# Altium project 20bit_40MS_ADC_DIOT.PrjPcb (part 1 of 5)
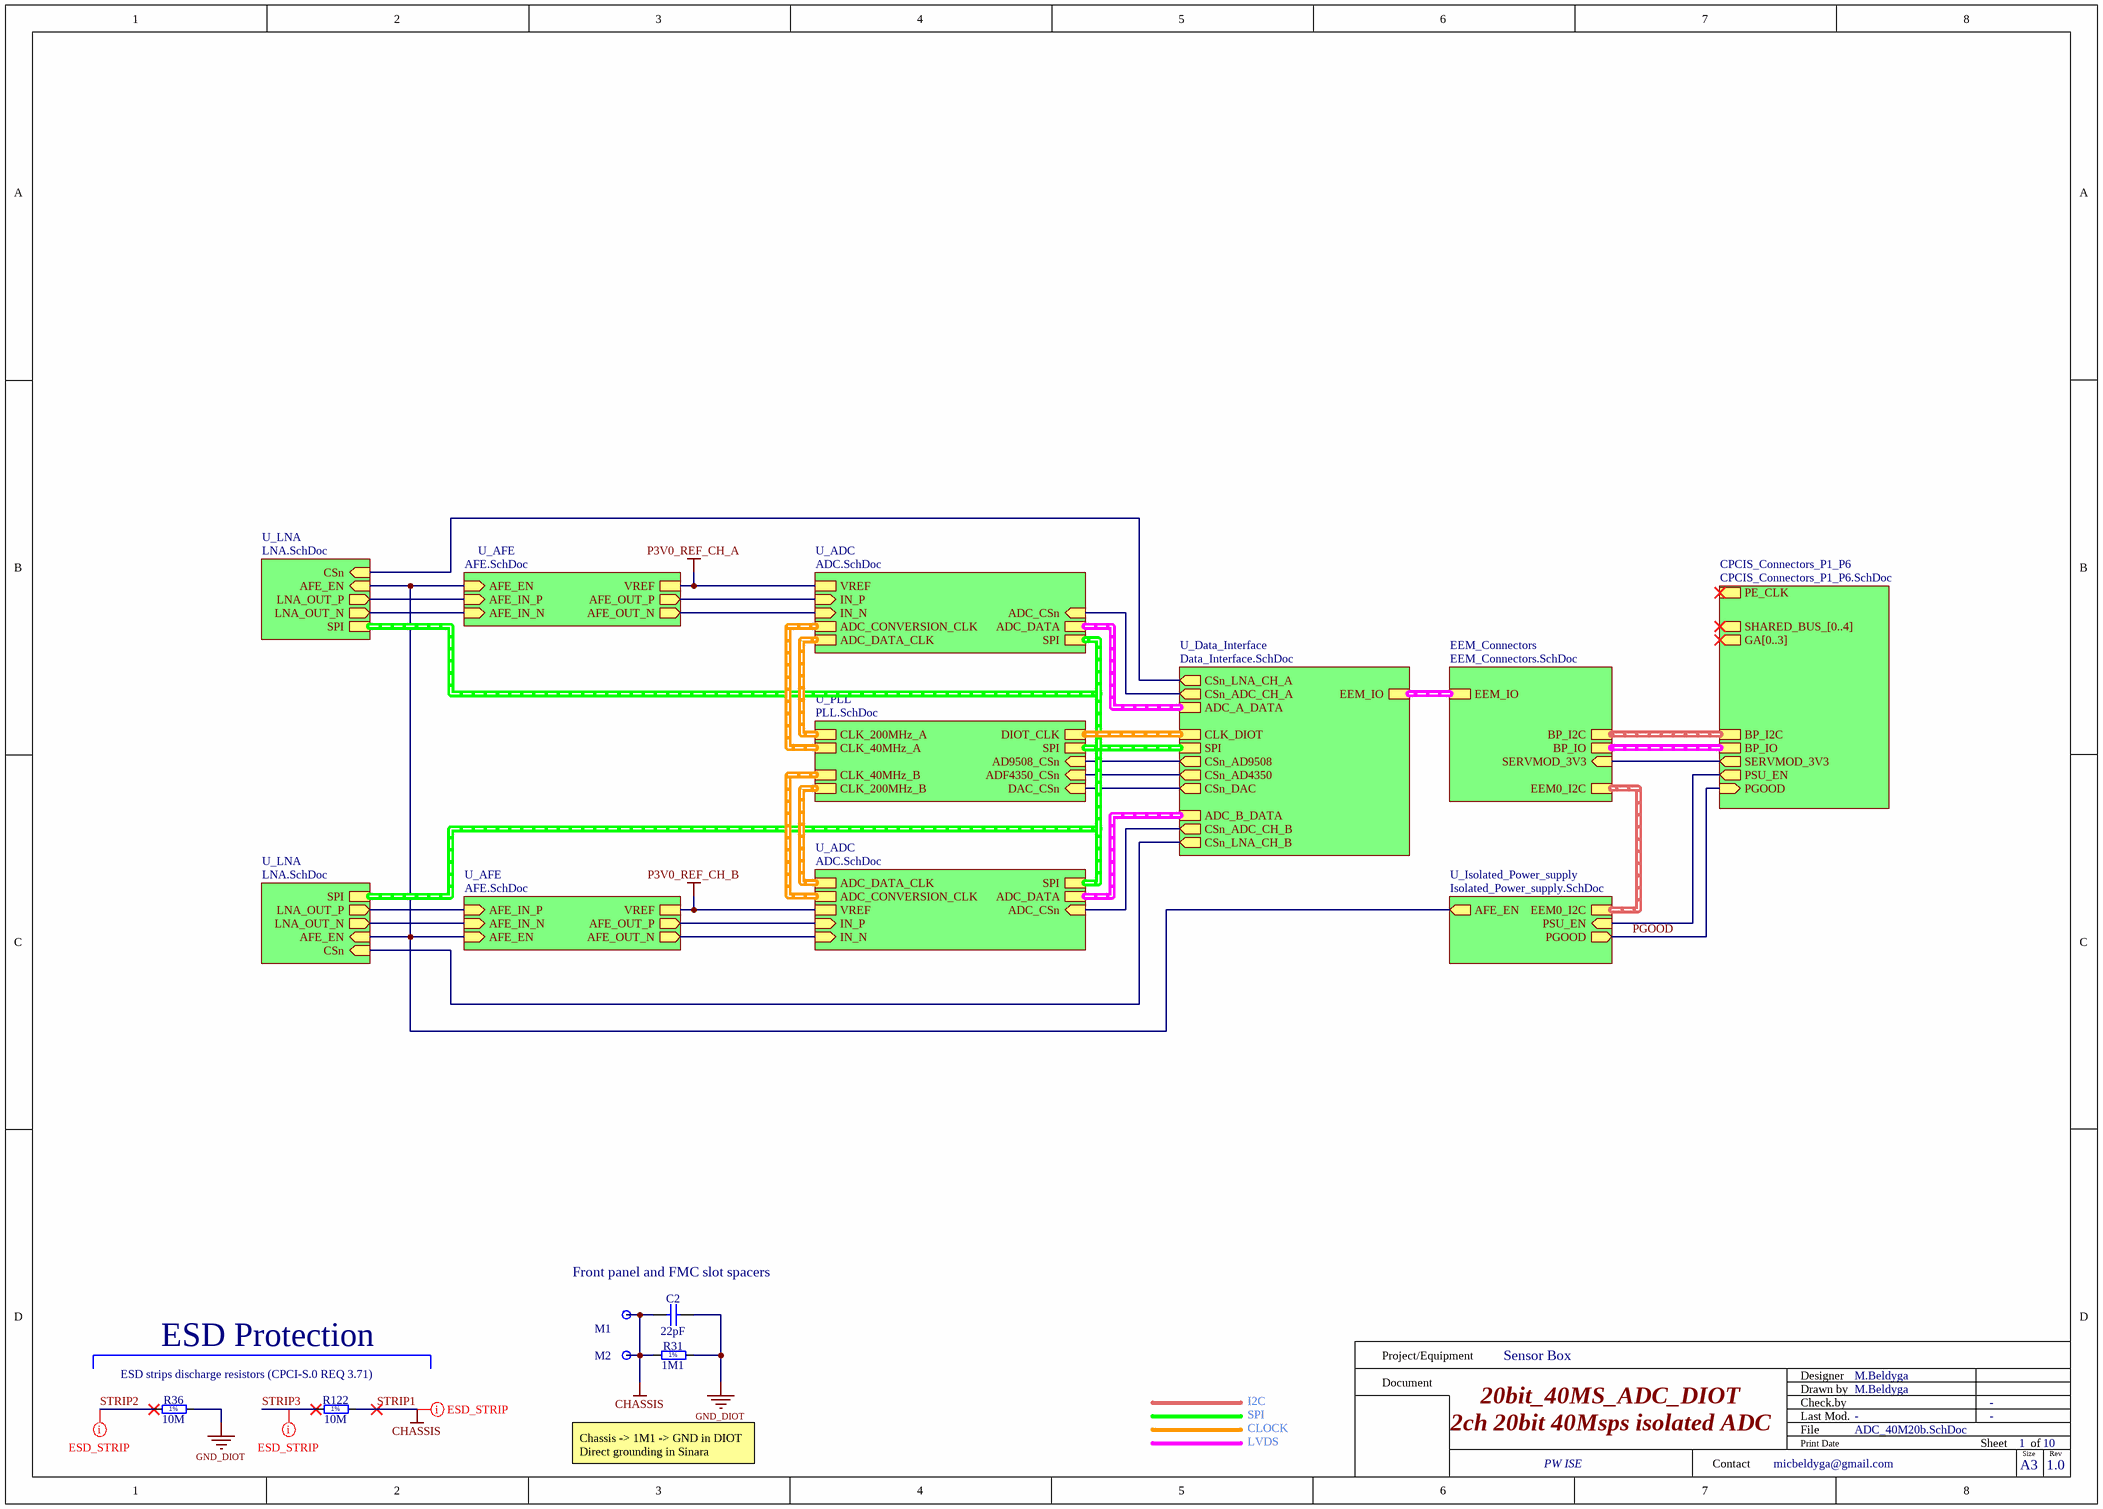
[diagram p0: ADC_40M20b.SchDoc]
Revision: 1.0
10 sheets, 625 parts. Net scope: hierarchical (ports join the sheet entries above them; power ports are global).
Board file: 20bit_40MS_ADC_DIOT.PcbDoc
Sheets:
  ADC_40M20b.SchDoc
    CPCIS_Connectors_P1_P6 = CPCIS_Connectors_P1_P6.SchDoc
    U_AFE = AFE.SchDoc
    U_LNA = LNA.SchDoc
    U_ADC = ADC.SchDoc
    U_PLL = PLL.SchDoc
    U_ADC = ADC.SchDoc
    U_AFE = AFE.SchDoc
    U_LNA = LNA.SchDoc
    U_Data_Interface = Data_Interface.SchDoc
      U_Optocouplers = Optocouplers.SchDoc
    EEM_Connectors = EEM_Connectors.SchDoc
    U_Isolated_Power_supply = Isolated_Power_supply.SchDoc

## Sheet ADC_40M20b.SchDoc: 20bit_40MS_ADC_DIOT
size A3; Author: M.Beldyga; CompanyName: WUT ISE; DrawnBy: M.Beldyga; Organization: WUT ISE; Address1: PW ISE; Address2: Nowowiejska 15/19 00-665 Warsaw; Address3: micbeldyga@gmail.com; SheetNumber: 1; SheetTotal: 10; ModifiedBy: -; CheckedDate: -; Title2: 2ch 20bit 40Msps isolated ADC; DivGrp: WUT ISE; Designer: M.Beldyga; ModifiedDate: -; ProjectName: Sensor Box

### Parts
C2  22pF  [CAPC1005X55N]
M1  Plated Hole  [MTG300_600]  (value not drawn)  (no BOM)
M2  Plated Hole  [MTG300_600]  (value not drawn)  (no BOM)
R31  1M1  [RESC2012X60N]
R36  10M  [RESC2113X55N]
R122  10M  [RESC2113X55N]

### Sub-sheets
CPCIS_Connectors_P1_P6 = CPCIS_Connectors_P1_P6.SchDoc: BP_I2C (harness I2C), SERVMOD_3V3 (out), PSU_EN (out), PE_CLK (harness CLK_DIFF), GA[0..3] (out), BP_IO (harness EEM_LVDS), SHARED_BUS_[0..4] (out), PGOOD (in)
EEM_Connectors = EEM_Connectors.SchDoc: EEM_IO (harness EEM_LVDS), BP_IO (harness EEM_LVDS), EEM0_I2C (harness I2C), BP_I2C (harness I2C), SERVMOD_3V3 (in)
U_ADC = ADC.SchDoc: ADC_DATA (harness ADC_LVDS), SPI (harness SPI), ADC_CONVERSION_CLK (harness DIFF_CLK), ADC_DATA_CLK (harness DIFF_CLK), IN_P (in), IN_N (in), ADC_CSn (in), VREF
U_ADC = ADC.SchDoc: ADC_DATA (harness ADC_LVDS), SPI (harness SPI), ADC_CONVERSION_CLK (harness DIFF_CLK), ADC_DATA_CLK (harness DIFF_CLK), IN_P (in), IN_N (in), ADC_CSn (in), VREF
U_AFE = AFE.SchDoc: AFE_OUT_P (out), AFE_OUT_N (out), AFE_IN_P (in), AFE_IN_N (in), AFE_EN (in), VREF
U_AFE = AFE.SchDoc: AFE_OUT_P (out), AFE_OUT_N (out), AFE_IN_P (in), AFE_IN_N (in), AFE_EN (in), VREF
U_Data_Interface = Data_Interface.SchDoc: ADC_A_DATA (harness ADC_LVDS), ADC_B_DATA (harness ADC_LVDS), SPI (harness SPI), CLK_DIOT (harness DIFF_CLK), CSn_ADC_CH_A (out), CSn_ADC_CH_B (out), CSn_AD9508 (out), CSn_AD4350 (out), CSn_LNA_CH_A (out), CSn_LNA_CH_B (out), EEM_IO (harness EEM_LVDS), CSn_DAC (out)
U_Isolated_Power_supply = Isolated_Power_supply.SchDoc: PSU_EN (in), EEM0_I2C (harness I2C), PGOOD (out), AFE_EN (out)
U_LNA = LNA.SchDoc: LNA_OUT_P (out), LNA_OUT_N (out), SPI (harness SPI), AFE_EN (in), CSn (in)
U_LNA = LNA.SchDoc: LNA_OUT_P (out), LNA_OUT_N (out), SPI (harness SPI), AFE_EN (in), CSn (in)
U_PLL = PLL.SchDoc: CLK_40MHz_A (harness DIFF_CLK), CLK_200MHz_A (harness DIFF_CLK), CLK_40MHz_B (harness DIFF_CLK), CLK_200MHz_B (harness DIFF_CLK), SPI (harness SPI), ADF4350_CSn (in), AD9508_CSn (in), DIOT_CLK (harness DIFF_CLK), DAC_CSn (in)

### Nets
GND_DIOT: C2.2 R31.2 R36.2  [project net GND]
P3V0_REF_CH_A: sheet U_AFE/VREF, sheet U_ADC/VREF, sheet U_ADC/VREF, sheet U_AFE/VREF  [also labelled P3V0_REF_CH_B]  [project net P3V0_REF]
STRIP1: C2.1 M1.1 M2.1 R31.1 R122.2  [also labelled CHASSIS]
ADC_CSn: sheet U_ADC/ADC_CSn, sheet U_Data_Interface/CSn_ADC_CH_A
ADC_CSn: sheet U_ADC/ADC_CSn, sheet U_Data_Interface/CSn_ADC_CH_B  [a separate net that carries the same name]
ADCIN_N: sheet U_AFE/AFE_OUT_N, sheet U_ADC/IN_N
ADCIN_N: sheet U_ADC/IN_N, sheet U_AFE/AFE_OUT_N  [a separate net that carries the same name]
ADCIN_P: sheet U_AFE/AFE_OUT_P, sheet U_ADC/IN_P
ADCIN_P: sheet U_ADC/IN_P, sheet U_AFE/AFE_OUT_P  [a separate net that carries the same name]
AFE_EN: sheet U_AFE/AFE_EN, sheet U_LNA/AFE_EN, sheet U_AFE/AFE_EN, sheet U_LNA/AFE_EN, sheet U_Isolated_Power_supply/AFE_EN
AFE_IN_N: sheet U_AFE/AFE_IN_N, sheet U_LNA/LNA_OUT_N
AFE_IN_N: sheet U_AFE/AFE_IN_N, sheet U_LNA/LNA_OUT_N  [a separate net that carries the same name]
AFE_IN_P: sheet U_AFE/AFE_IN_P, sheet U_LNA/LNA_OUT_P
AFE_IN_P: sheet U_AFE/AFE_IN_P, sheet U_LNA/LNA_OUT_P  [a separate net that carries the same name]
CSn_AD4350: sheet U_PLL/ADF4350_CSn, sheet U_Data_Interface/CSn_AD4350
CSn_AD9508: sheet U_PLL/AD9508_CSn, sheet U_Data_Interface/CSn_AD9508
CSn_DAC: sheet U_PLL/DAC_CSn, sheet U_Data_Interface/CSn_DAC
CSn_LNA_CH_A: sheet U_LNA/CSn, sheet U_Data_Interface/CSn_LNA_CH_A
CSn_LNA_CH_B: sheet U_LNA/CSn, sheet U_Data_Interface/CSn_LNA_CH_B
PGOOD: sheet CPCIS_Connectors_P1_P6/PGOOD, sheet U_Isolated_Power_supply/PGOOD
PSU_EN: sheet CPCIS_Connectors_P1_P6/PSU_EN, sheet U_Isolated_Power_supply/PSU_EN
SERVMOD_3V3: sheet CPCIS_Connectors_P1_P6/SERVMOD_3V3, sheet EEM_Connectors/SERVMOD_3V3
STRIP2: R36.1
STRIP3: R122.1

### Buses and harness runs
harness sheet CPCIS_Connectors_P1_P6/BP_I2C = sheet EEM_Connectors/BP_I2C
harness sheet CPCIS_Connectors_P1_P6/BP_IO = sheet EEM_Connectors/BP_IO
harness sheet EEM_Connectors/EEM0_I2C = sheet U_Isolated_Power_supply/EEM0_I2C
harness sheet EEM_Connectors/EEM_IO = sheet U_Data_Interface/EEM_IO
harness sheet U_ADC/ADC_CONVERSION_CLK = sheet U_PLL/CLK_40MHz_A
harness sheet U_ADC/ADC_CONVERSION_CLK = sheet U_PLL/CLK_40MHz_B
harness sheet U_ADC/ADC_DATA = sheet U_Data_Interface/ADC_A_DATA
harness sheet U_ADC/ADC_DATA = sheet U_Data_Interface/ADC_B_DATA
harness sheet U_ADC/ADC_DATA_CLK = sheet U_PLL/CLK_200MHz_A
harness sheet U_ADC/ADC_DATA_CLK = sheet U_PLL/CLK_200MHz_B
harness sheet U_ADC/SPI = sheet U_Data_Interface/SPI = sheet U_LNA/SPI = sheet U_PLL/SPI
harness sheet U_Data_Interface/CLK_DIOT = sheet U_PLL/DIOT_CLK

### Layout directives
net class ESD_STRIP: STRIP1, STRIP2, STRIP3

### Notes on the sheet
- Front panel and FMC slot spacers
- ESD strips discharge resistors (CPCI-S.0 REQ 3.71)
- ESD Protection
- Chassis -> 1M1 -> GND in DIOT
  Direct grounding in Sinara
- I2C
- SPI
- CLOCK
- LVDS
- Project/Equipment
- Document
- Designer
- Drawn by
- Check.by
- Contact
- File
- Last Mod.
- Print Date
- Sheet
- Size
- A3
- of
- Rev
- (in symbol R0805_1M1_1%_0.125W_100PPM) 1%
- (in symbol R0805_10M_1%_0.125W_100PPM_VISHAY_CRCW e3) 1%

### Library data of the parts
C2 = CC0402_22PF_50V_5%_C0G: Non-polarised capacitor; Part Description: SMD Multilayer Chip Ceramic Capacitor; Manufacturer: GENERIC; Manufacturer1 Part Number: C0402C220J5GACTU; Voltage: 50V; TC: C0G/NP0; Tolerance: ±5%; Part Number: CC0402_22PF_50V_5%_C0G; Component Kind: Standard; Component Type: Standard; Pin Count: 2; Value: 22pF; Status: Preferred; Manufacturer Part Number: CC0402_22PF_50V_5%_C0G; Case: 0402; Mounted: Yes; Socket: No; SMD: Yes; Manufacturer1 Example: KEMET; Manufacturer1 ComponentHeight: 0.55mm; HelpURL: \\cern.ch\dfs\Applications\Altium\Datasheets\CC0402_C0G_KEMET_(Commercial Grade).pdf; Author: CERN DEM JLC; CreateDate: 2007-12-03; LatestRevisionDate: 2007-12-03; Sense: No
M1 M2 = PLATED_HOLE3.0_PAD6.0: Single Terminal Socket; Part Description: Plated Through Hole: Hole Dia.=3.0mm Pad Dia.=6.0mm; Mounted: No; Table: Pads; Part Number: PLATED_HOLE3.0_PAD6.0; Component Type: Standard (No BOM); Designator: Single Terminal Socket; Library Reference: Single Terminal Socket; Pin Count: 1; Family: Plated Hole; Socket: No; SMD: No; Status: None; ComponentHeight: 0mm; Author: CERN DEM JLC; CreateDate: 26.05.2008; LatestRevisionDate: 26.05.2008; PackageDescription: Plated Through Hole: Hole Dia.=3.0mm Pad Dia.=6.0mm
R31 = R0805_1M1_1%_0.125W_100PPM: Resistor - 1%; Part Description: General Purpose Thick Film Chip Resistor; Manufacturer: GENERIC; Manufacturer1 Part Number: NRC10F1104TRF; PressFit: No; Part Number: R0805_1M1_1%_0.125W_100PPM; Component Kind: Standard; Component Type: Standard; Pin Count: 2; Value: 1M1; Status: Preferred; Manufacturer Part Number: R0805_1M1_1%_0.125W_100PPM; Case: 0805; Mounted: Yes; Sense: No; Socket: No; SMD: Yes; Manufacturer1 Example: NIC COMPONENT; Manufacturer1 ComponentHeight: 0.6mm; HelpURL: \\cern.ch\dfs\Applications\Altium\Datasheets\R0805_NIC_NRC.pdf; Author: CERN DEM JLC; CreateDate: 03/12/2007; LatestRevisionDate: 13/03/2008
R36 R122 = R0805_10M_1%_0.125W_100PPM_VISHAY_CRCW e3: Resistor - 1%; Part Description: 150V, Standard Thick Film Chip Resistor; Manufacturer: VISHAY DALE; Manufacturer Part Number: CRCW080510M0FKEA; Power: 0.125W; TC: ±100ppm/°C; PressFit: No; Part Number: R0805_10M_1%_0.125W_100PPM_VISHAY_CRCW e3; Component Kind: Standard; Component Type: Standard; Pin Count: 2; Value: 10M; Status: None; Tolerance: ±1%; Case: 0805; Mounted: Yes; Sense: No; Socket: No; SMD: Yes; ComponentHeight: 0.5mm; HelpURL: \\cern.ch\dfs\Applications\Altium\Datasheets\R0805_VISHAY_CRCW e3.pdf; Author: CERN DEM BC; CreateDate: 2019-11-12; LatestRevisionDate: 2019-11-12

## Sheet CPCIS_Connectors_P1_P6.SchDoc: DIOT
size 420 x 297 mm; SPICEModelCacheRMUUFYQV: <root> / <DocumentId>RMUUFYQV</DocumentId> / </root>; CheckedBy: P.Kulik; Author: G.Kasprowicz; CompanyName: WUT ISE; DrawnBy: G.Kasprowicz; Organization: WUT ISE; Address1: PW ISE; Address2: Nowowiejska 15/19 00-665 Warsaw; Address3: gkasprow@gmail.com; Revision: 2; SheetNumber: 9; SheetTotal: 10; ModifiedBy: -; CheckedDate: -; Title2: connectors; DivGrp: WUT ISE; Designer: G.Kasprowicz; ModifiedDate: -; ProjectName: Sensor Box
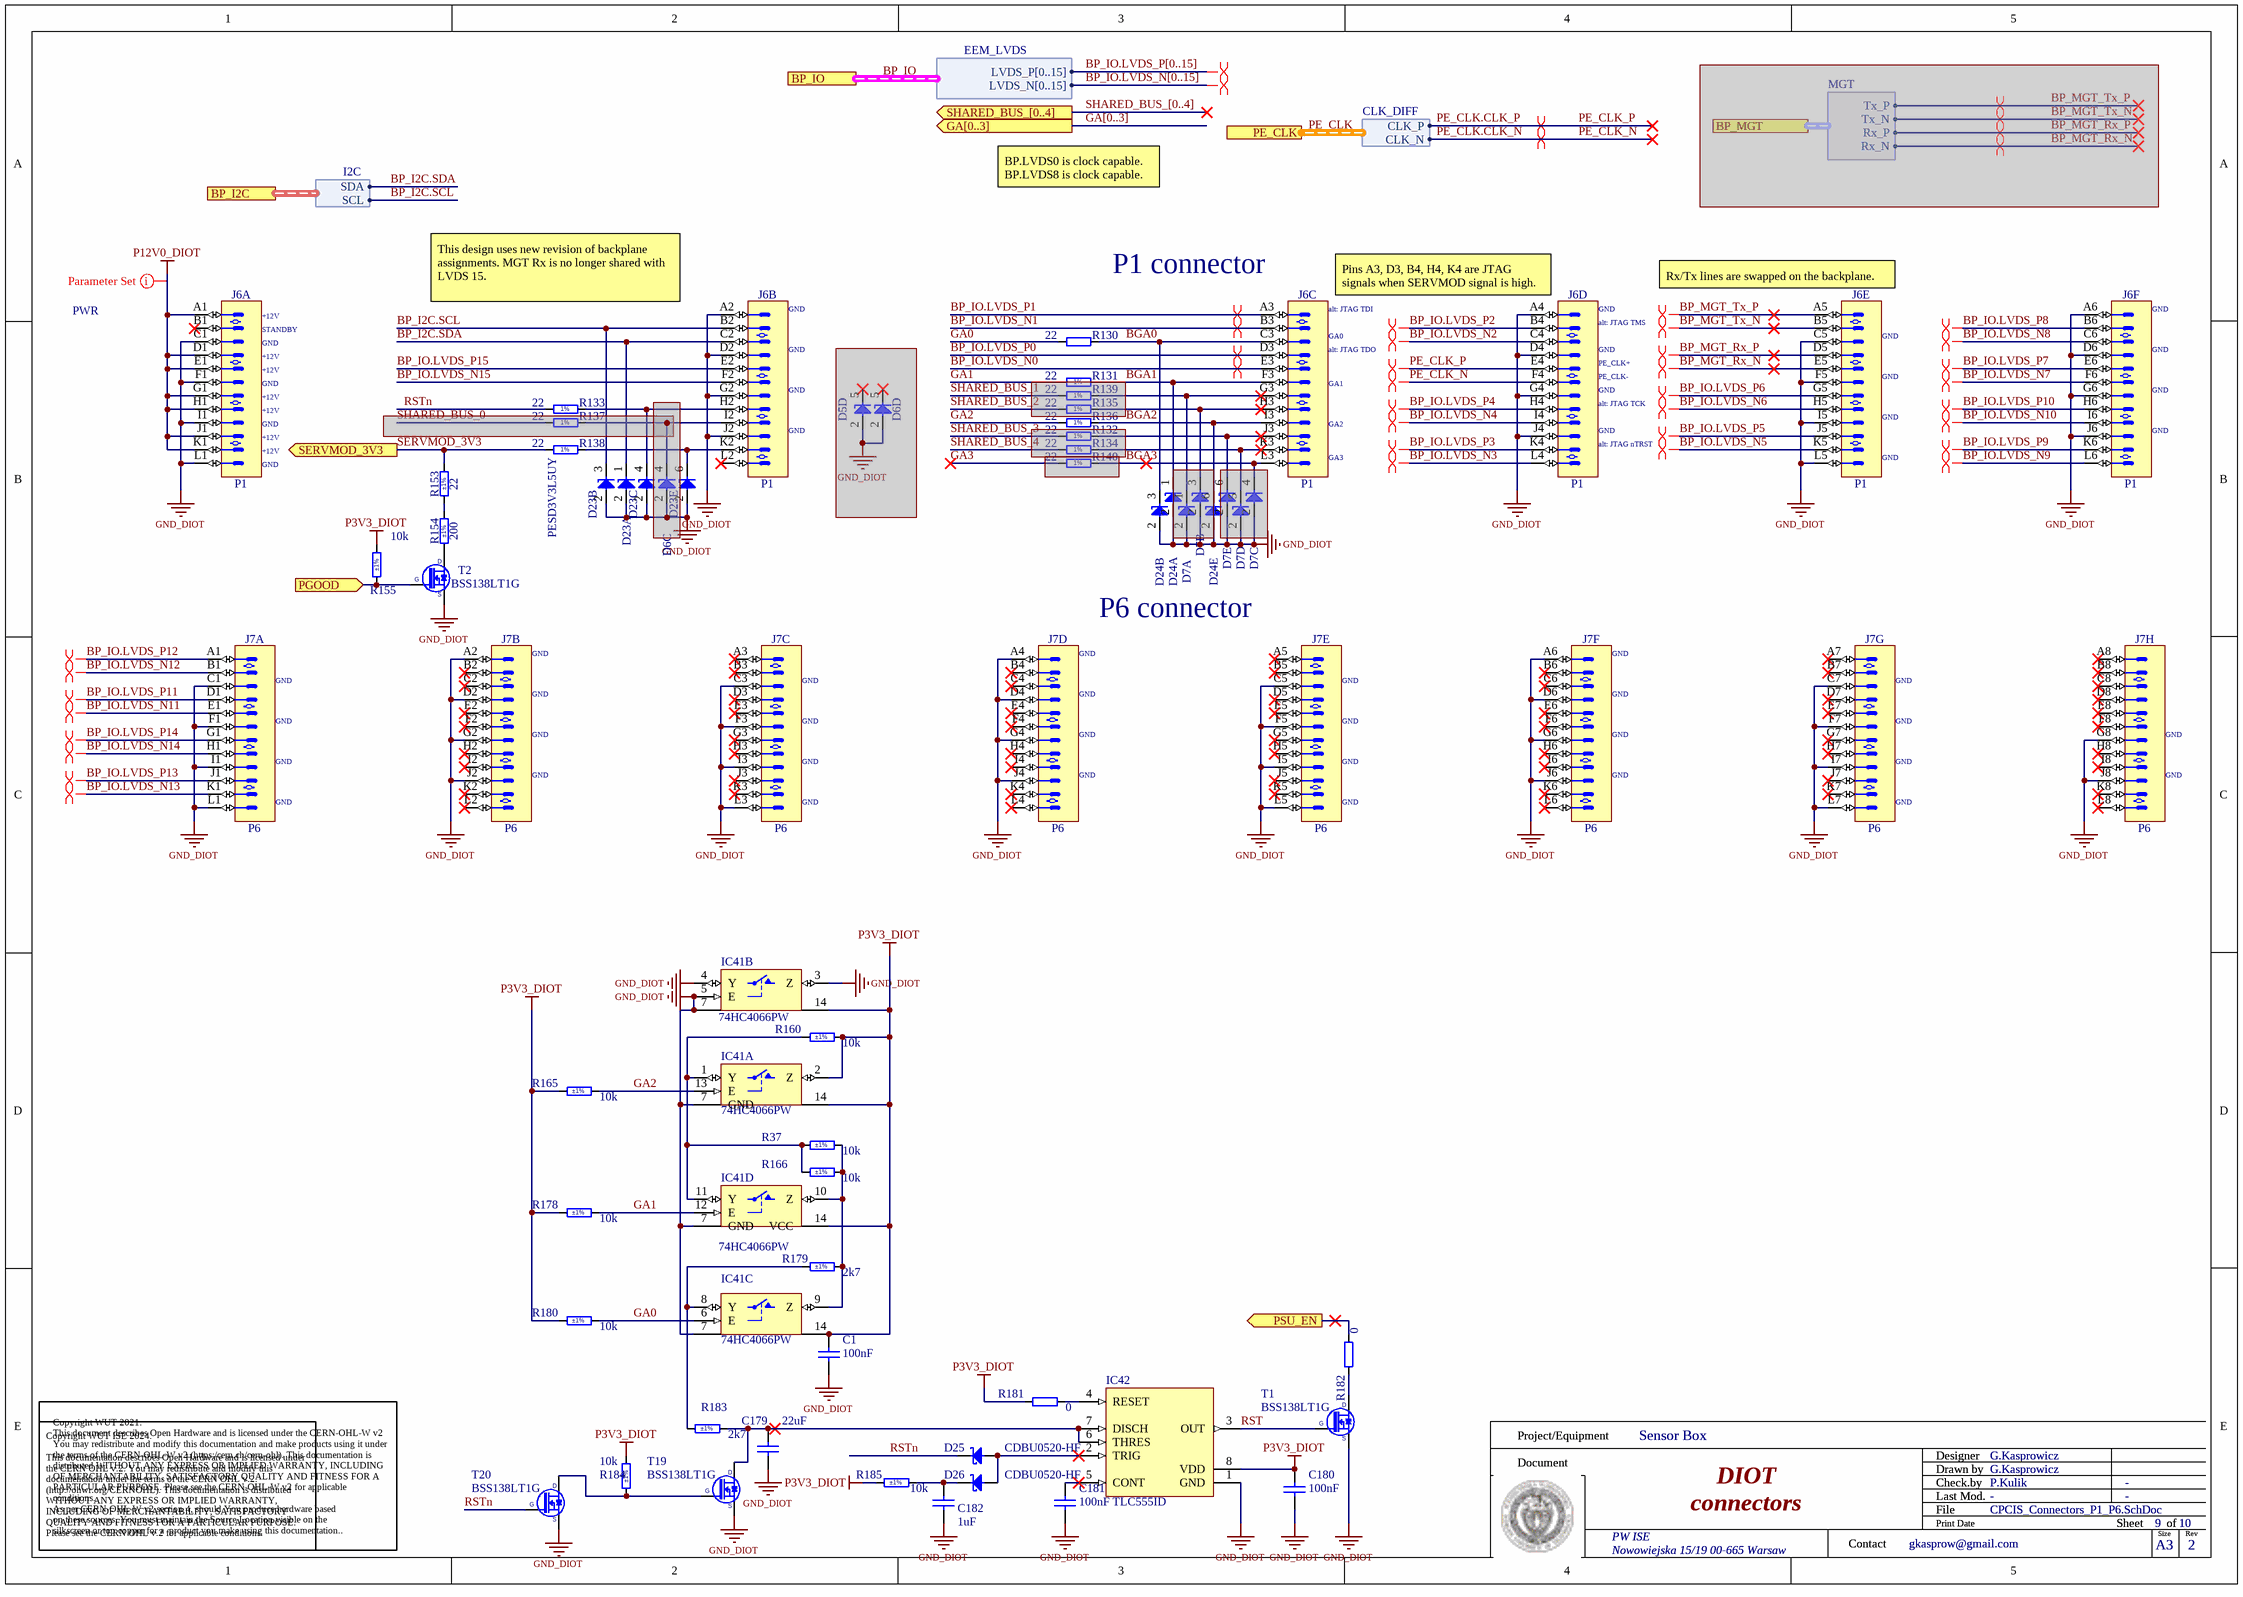
[diagram p1: CPCIS_Connectors_P1_P6.SchDoc]

### Parts
(Parts that share a designator on the sheet are numbered #1, #2 ... from top to bottom, then left to right.)
C1  100nF  [CAPC1005X55N]
C179  22uF  [CAPC2012X135N]
C180  100nF  [CAPC1005X55N]
C181  100nF  [CAPC1005X55N]
C182  1uF  [CAPC1608X87N]
D5#1  PESD3V3L5UY  [SOT65P210X110-6N]  (value not drawn)  (part D of 5)  (masked out: inside a compile mask, not in the netlist)
D6#1  PESD3V3L5UY  [SOT65P210X110-6N]  (value not drawn)  (parts C,D of 5)  (masked out: inside a compile mask, not in the netlist)
D7#1  PESD3V3L5UY  [SOT65P210X110-6N]  (value not drawn)  (parts A,B,C,D,E of 5)  (masked out: inside a compile mask, not in the netlist)
D23  PESD3V3L5UY  [SOT65P210X110-6N]  (value not drawn)  (parts A,B,C,E of 5)
D24  PESD3V3L5UY  [SOT65P210X110-6N]  (value not drawn)  (parts A,B,E of 5)  (masked out: inside a compile mask, not in the netlist)
D25  CDBU0520-HF  [SOD-523F]
D26  CDBU0520-HF  [SOD-523F]
IC41  74HC4066PW  [SOP65P640X110-14N]  (parts A,B,C,D of 4)
IC42  TLC555ID  [SOIC127P600X175-8N]
J6  P1  [AMPHENOL_10052825-101LF]  (parts A,B,C,D,E,F of 6)
J7  P6  [AMPHENOL_10052838-101LF]  (parts A,B,C,D,E,F,G,H of 8)
R37  10k  Tolerance: ±1%  [RESC1608X55N]
R130  22  [RESC1005X40N]
R131  22  [RESC1005X40N]  (masked out: inside a compile mask, not in the netlist)
R132#1  22  [RESC1005X40N]  (masked out: inside a compile mask, not in the netlist)
R133  22  [RESC1005X40N]
R134#1  22  [RESC1005X40N]  (masked out: inside a compile mask, not in the netlist)
R135#1  22  [RESC1005X40N]  (masked out: inside a compile mask, not in the netlist)
R136  22  [RESC1005X40N]
R137#1  22  [RESC1005X40N]  (masked out: inside a compile mask, not in the netlist)
R138  22  [RESC1005X40N]
R139#1  22  [RESC1005X40N]  (masked out: inside a compile mask, not in the netlist)
R140#1  22  [RESC1005X40N]  (masked out: inside a compile mask, not in the netlist)
R153  22  Tolerance: ±1%  [RESC1005X40N]
R154  200  Tolerance: ±1%  [RESC1005X40N]
R155  10k  Tolerance: ±1%  [RESC1608X55N]
R160  10k  Tolerance: ±1%  [RESC1608X55N]
R165  10k  Tolerance: ±1%  [RESC1608X55N]
R166  10k  Tolerance: ±1%  [RESC1608X55N]
R178  10k  Tolerance: ±1%  [RESC1608X55N]
R179  2k7  Tolerance: ±1%  [RESC1608X55N]
R180  10k  Tolerance: ±1%  [RESC1608X55N]
R181  0  [RESC1005X40N]
R182  0  [RESC1005X40N]
R183  2k7  Tolerance: ±1%  [RESC1608X55N]
R184  10k  Tolerance: ±1%  [RESC1608X55N]
R185  10k  Tolerance: ±1%  [RESC1608X55N]
T1  BSS138LT1G  [SOT95P240X110-3N]
T2  BSS138LT1G  [SOT95P240X110-3N]
T19  BSS138LT1G  [SOT95P240X110-3N]
T20  BSS138LT1G  [SOT95P240X110-3N]

### Ports
BP_I2C (harness I2C), BP_IO (harness EEM_LVDS), BP_MGT (harness MGT), GA[0..3] (out), PE_CLK (harness CLK_DIFF), PGOOD (in), PSU_EN (out), SERVMOD_3V3 (out), SHARED_BUS_[0..4] (out)

### Harnesses
MGT: Tx_P, Tx_N, Rx_P, Rx_N
CLK_DIFF: CLK_N, CLK_P
I2C: SDA, SCL
EEM_LVDS: LVDS_P[0..15], LVDS_N[0..15]

### Nets
GND: C1.1 C179.1 C180.1 C181.1 C182.1 D23.2(A) D24.2(A) IC41.3(Z) IC41.4(Y) IC41.5(E) IC41.7(GND) IC42.1(GND) J6.A2 J6.A4 J6.A6 J6.C1 J6.C5 J6.D2 J6.D4 J6.D6 J6.F1 J6.F5 J6.G2 J6.G4 J6.G6 J6.I1 J6.I5 J6.J2 J6.J4 J6.J6 J6.L1 J6.L5 J7.A2 J7.A4 J7.A6 J7.C1 J7.C3 J7.C5 J7.C7 J7.D2 J7.D4 J7.D6 J7.F1 J7.F3 J7.F5 J7.F7 J7.G2 J7.G4 J7.G6 J7.G8 J7.I1 J7.I3 J7.I5 J7.I7 J7.J2 J7.J4 J7.J6 J7.J8 J7.L1 J7.L3 J7.L5 J7.L7 T1.2(S) T2.2(S) T19.2(S) T20.2(S)  [also labelled GND_DIOT]
P3V3_DIOT: C1.2 C180.2 IC41.2(Z) IC41.14(VCC) IC42.8(VDD) R155.2 R160.2 R165.1 R178.1 R180.1 R181.1 R184.2 R185.1
P12V0_DIOT: J6.A1 J6.D1 J6.E1 J6.G1 J6.H1 J6.J1 J6.K1
BGA0: D24.3(C) J6.C3 R130.2
BGA2: J6.I3 R136.2
BGA3: J6.L3
BP_I2C.SCL: D23.3(C) J6.B2 ; port BP_I2C.SCL
BP_I2C.SDA: D23.1(C) J6.C2 ; port BP_I2C.SDA
BP_IO.LVDS_N0: J6.E3
BP_IO.LVDS_N1: J6.B3
BP_IO.LVDS_N2: J6.C4
BP_IO.LVDS_N3: J6.L4
BP_IO.LVDS_N4: J6.I4
BP_IO.LVDS_N5: J6.K5
BP_IO.LVDS_N6: J6.H5
BP_IO.LVDS_N7: J6.F6
BP_IO.LVDS_N8: J6.C6
BP_IO.LVDS_N9: J6.L6
BP_IO.LVDS_N10: J6.I6
BP_IO.LVDS_N11: J7.E1
BP_IO.LVDS_N12: J7.B1
BP_IO.LVDS_N13: J7.K1
BP_IO.LVDS_N14: J7.H1
BP_IO.LVDS_N15: J6.F2
BP_IO.LVDS_P0: J6.D3
BP_IO.LVDS_P1: J6.A3
BP_IO.LVDS_P2: J6.B4
BP_IO.LVDS_P3: J6.K4
BP_IO.LVDS_P4: J6.H4
BP_IO.LVDS_P5: J6.J5
BP_IO.LVDS_P6: J6.G5
BP_IO.LVDS_P7: J6.E6
BP_IO.LVDS_P8: J6.B6
BP_IO.LVDS_P9: J6.K6
BP_IO.LVDS_P10: J6.H6
BP_IO.LVDS_P11: J7.D1
BP_IO.LVDS_P12: J7.A1
BP_IO.LVDS_P13: J7.J1
BP_IO.LVDS_P14: J7.G1
BP_IO.LVDS_P15: J6.E2
BP_MGT_Rx_N: J6.E5
BP_MGT_Rx_P: J6.D5
BP_MGT_Tx_N: J6.B5
BP_MGT_Tx_P: J6.A5
GA0: IC41.6(E) R130.1 R180.2
GA1: IC41.12(E) R178.2
GA2: IC41.13(E) R136.1 R165.2
PE_CLK.CLK_N: J6.F4 ; port PE_CLK.CLK_N  [also labelled PE_CLK_N]
PE_CLK.CLK_P: J6.E4 ; port PE_CLK.CLK_P  [also labelled PE_CLK_P]
PGOOD: R155.1 T2.1(G) ; port PGOOD
PSU_EN: R182.2 ; port PSU_EN
RST: IC42.3(OUT) T1.1(G)
RSTn: D25.1(C) R133.1 T20.1(G)
SERVMOD_3V3: R138.1 R153.2 ; port SERVMOD_3V3
NetC179_2: C179.2 IC42.6(THRES) IC42.7(DISCH) R183.2 T19.3(D)
NetC181_2: C181.2 IC42.5(CONT)
NetC182_2: C182.2 D26.1(C) R185.2
NetD23_4: D23.4(C) J6.H2 R133.2
NetD23_6: D23.6(C) J6.K2 R138.2
NetD25_2: D25.2(A) D26.2(A) IC42.2(TRIG)
NetIC41_1: IC41.1(Y) IC41.11(Y) R37.1 R160.1 R166.1
NetIC41_8: IC41.8(Y) R179.1 R183.1
NetIC41_9: IC41.9(Z) IC41.10(Z) R37.2 R166.2 R179.2
NetIC42_4: IC42.4(RESET) R181.2
NetR153_1: R153.1 R154.2
NetR154_1: R154.1 T2.3(D)
NetR182_1: R182.1 T1.3(D)
NetR184_1: R184.1 T19.1(G) T20.3(D)

Not connected (* = marked no-connect by the designer): J6 B1* F3 G3* H3* I2 J3* K3* L2*; J7 A3* A5* A7* A8* B2* B3* B4* B5* B6* B7* B8* C2* C4* C6* C8* D3* D5* D7* D8* E2* E3* E4* E5* E6* E7* E8* F2* F4* F6* F8* G3* G5* G7* H2* H3* H4* H5* H6* H7* H8* I2* I4* I6* I8* J3* J5* J7* K2* K3* K4* K5* K6* K7* K8* L2* L4* L6* L8*

### Buses and harness runs
bus BP_IO.LVDS_N[0..15]
bus BP_IO.LVDS_P[0..15]
bus GA[0..3] = port GA[0..3]
bus SHARED_BUS_[0..4] = port SHARED_BUS_[0..4]
harness BP_IO = port BP_IO
harness PE_CLK = port PE_CLK

### Layout directives
differential pair: (no net found under the mark), BP_IO.LVDS_N0, BP_IO.LVDS_N1, BP_IO.LVDS_N2, BP_IO.LVDS_N3, BP_IO.LVDS_N4, BP_IO.LVDS_N5, BP_IO.LVDS_N6, BP_IO.LVDS_N7, BP_IO.LVDS_N8, BP_IO.LVDS_N9, BP_IO.LVDS_N10, BP_IO.LVDS_N11, BP_IO.LVDS_N12, BP_IO.LVDS_N13, BP_IO.LVDS_N14, BP_IO.LVDS_P0, BP_IO.LVDS_P1, BP_IO.LVDS_P2, BP_IO.LVDS_P3, BP_IO.LVDS_P4, BP_IO.LVDS_P5, BP_IO.LVDS_P6, BP_IO.LVDS_P7, BP_IO.LVDS_P8, BP_IO.LVDS_P9, BP_IO.LVDS_P10, BP_IO.LVDS_P11, BP_IO.LVDS_P12, BP_IO.LVDS_P13, BP_IO.LVDS_P14
differential pair; differential pair class Diff_100Ohm: PE_CLK.CLK_N, PE_CLK.CLK_P
differential pair; differential pair class MGT: (no net found under the mark), BP_MGT_Rx_N, BP_MGT_Rx_P, BP_MGT_Tx_N, BP_MGT_Tx_P
net class PWR: P12V0_DIOT

### Notes on the sheet
- BP.LVDS0 is clock capable.
  BP.LVDS8 is clock capable.
- (near J6) +12V
- This design uses new revision of backplane assignments. MGT Rx is no longer shared with LVDS 15.
- (near J6) GND
- (near J6) P1 connector
- (near J6) alt: JTAG TDI
- (near J6) Pins A3, D3, B4, H4, K4 are JTAG signals when SERVMOD signal is high.
- (near J6) alt: JTAG TMS
- (near J6) Rx/Tx lines are swapped on the backplane.
- (near J6) STANDBY
- GND
- (near J6) alt: JTAG TDO
- (near J6) GA1
- (near J6) GA0
- (near J6) PE_CLK+
- (near J6) PE_CLK-
- (near J6) GA2
- (near J6) GA3
- (near J6) alt: JTAG TCK
- (near J6) alt: JTAG nTRST
- (near J7) GND
- (near J7) P6 connector
- Project/Equipment
- Document
- Designer
- Drawn by
- Check.by
- Copyright WUT ISE 2024.
  This documentation describes Open Hardware and is licensed under the CERN OHL v.2. You may redistribute and modify this documentation under the terms of the CERN OHL v.2. (http://ohwr.org/CERNOHL). This documentation is distributed WITHOUT ANY EXPRESS OR IMPLIED WARRANTY, INCLUDING OF MERCHANTABILITY, SATISFACTORY QUALITY AND FITNESS FOR A PARTICULAR PURPOSE. Please see the CERN OHL v.2 for applicable conditions.
- Contact
- File
- Last Mod.
- Print Date
- Sheet
- Size
- A3
- of
- Rev
- Copyright WUT 2021.
  This document describes Open Hardware and is licensed under the CERN-OHL-W v2
  You may redistribute and modify this documentation and make products using it under the terms of the CERN-OHL-W v2 (https:/cern.ch/cern-ohl). This documentation is distributed WITHOUT ANY EXPRESS OR IMPLIED WARRANTY, INCLUDING OF MERCHANTABILITY, SATISFACTORY QUALITY AND FITNESS FOR A PARTICULAR PURPOSE. Please see the CERN-OHL-W v2 for applicable conditions.
  As per CERN-OHL-W v2 section 4, should You produce hardware based
  on these sources, You must maintain the Source Location visible on the
  silkscreen or top copper for a  product you make using this documentation..
- (in symbol R0402_22R_1%_0.0625W_100PPM) 1%

### Library data of the parts
C1 C180 C181 = CC0402_100NF_50V_10%_X7R: Non-polarised capacitor; Part Description: SMD Multilayer Chip Ceramic Capacitor; Manufacturer: GENERIC; Manufacturer1 Part Number: GRM155R71H104KE14D; Voltage: 50V; TC: X7R; Tolerance: ±10%; Part Number: CC0402_100NF_50V_10%_X7R; Component Kind: Standard; Component Type: Standard; Pin Count: 2; Value: 100nF; Status: None; Manufacturer Part Number: CC0402_100NF_50V_10%_X7R; Case: 0402; Mounted: Yes; Socket: No; SMD: Yes; Sense: No; Manufacturer1 Example: MURATA; Manufacturer1 ComponentHeight: 0.55mm; HelpURL: \\cern.ch\dfs\Applications\Altium\Datasheets\CC0402_MURATA_GRM155R71H104KE14D.pdf; Author: CERN DEM MR; CreateDate: 30.06.2017; LatestRevisionDate: 30.06.2017
C179 = CC0805_22UF_16V_10%_X5R: Non-polarised capacitor; Part Description: SMD Multilayer Chip Ceramic Capacitor; Manufacturer: GENERIC; Manufacturer1 Part Number: C2012X5R1C226KT; Voltage: 16V; TC: X5R; Tolerance: ±10%; Part Number: CC0805_22UF_16V_10%_X5R; Component Kind: Standard; Component Type: Standard; Pin Count: 2; Value: 22uF; Status: Preferred; Manufacturer Part Number: CC0805_22UF_16V_10%_X5R; Case: 0805; Mounted: Yes; Socket: No; SMD: Yes; Sense: No; Manufacturer1 Example: TDK; Manufacturer1 ComponentHeight: 1.35mm; HelpURL: \\cern.ch\dfs\Applications\Altium\Datasheets\CC0805_X5R_TDK_C.pdf; Author: CERN DEM JLC; CreateDate: 25.10.2012; LatestRevisionDate: 25.10.2012
C182 = CC0603_1UF_25V_10%_X7R: Non-polarised capacitor; Part Description: SMD Multilayer Chip Ceramic Capacitor; Manufacturer: GENERIC; Manufacturer1 Part Number: GRM188R71E105KA12D; Voltage: 25V; TC: X7R; Tolerance: ±10%; Part Number: CC0603_1UF_25V_10%_X7R; Component Kind: Standard; Component Type: Standard; Pin Count: 2; Value: 1uF; Status: None; Manufacturer Part Number: CC0603_1UF_25V_10%_X7R; Case: 0603; Mounted: Yes; Socket: No; SMD: Yes; Sense: No; Manufacturer1 Example: MURATA; Manufacturer1 ComponentHeight: 0.9mm; HelpURL: \\cern.ch\dfs\Applications\Altium\Datasheets\CC0603_X7R_MURATA.pdf; Author: CERN DEM JLC; CreateDate: 18.01.2011; LatestRevisionDate: 18.01.2011
D5#1 D6#1 D7#1 D23 D24 = PESD3V3L5UY: Fivefold ESD Protection Diode Arrays; Part Description: Fivefold ESD Protection Diode Arrays (30kV); Manufacturer: NEXPERIA; Voltage: 3.3V; Power: 200W; PressFit: No; Bonding: No; Part Number: PESD3V3L5UY; Component Kind: Standard; Component Type: Standard; Device: PESD3V3L5UY; PackageDescription: SOT363, SC-88, 0.65mm Pitch; 6 Pin, 1.25mm W X 2.00mm L X 1.10mm H body, IPC Medium Density; Manufacturer Part Number: PESD3V3L5UY; Pin Count: 6; Case: SOT363; Mounted: Yes; Socket: No; SMD: Yes; Sense: No; ComponentHeight: 1.1mm; HelpURL: \\cern.ch\dfs\Applications\Altium\Datasheets\PESD3V3L5UY.pdf; Author: CERN DEM WB; CreateDate: 05.07.2021; LatestRevisionDate: 05.07.2021
D25 D26 = CDBU0520-HF: Schottky Diode; Part Description: 20V Surface mount Schottky Barrier Diode; Manufacturer: COMCHIP; Voltage: 20V; Power: 500mA; PressFit: No; Bonding: No; Part Number: CDBU0520-HF; Component Kind: Standard; Component Type: Standard; Device: CDBU0520-HF; PackageDescription: Small Outline Diode Flat Lead (SOD-523F), Body; 1.80mm L X 1mm W X 0.85mm H; Manufacturer Part Number: CDBU0520-HF; Pin Count: 2; Case: SOD-523F; Mounted: Yes; Socket: No; SMD: Yes; Sense: No; ComponentHeight: 1mm; HelpURL: \\cern.ch\dfs\Applications\Altium\Datasheets\CDBU0520-HF.pdf; Author: CERN DEM HF; CreateDate: 13.10.2023; LatestRevisionDate: 13.10.2023
IC41 = 74HC4066PW: Part Description: Quad Single-Pole Single-Throw Analog Switch; Manufacturer: NXP SEMICONDUCTORS; PressFit: No; Bonding: No; Table: Standard Logic; Part Number: 74HC4066PW; Component Kind: Standard; Component Type: Standard; Device: 74HC4066PW; PackageDescription: SOP, 14-Leads, Body 4.4x5mm (max), Pitch 0.65mm, IPC Medium Density; Manufacturer Part Number: 74HC4066PW; Pin Count: 14; Case: TSSOP14; Mounted: Yes; Socket: No; SMD: Yes; ComponentHeight: 1.1mm; Author: CERN DEM JLC; HelpURL: \\cern.ch\dfs\Applications\Altium\Datasheets\74HC4066PW.pdf; CreateDate: 2014-11-19; LatestRevisionDate: 2014-11-19
IC42 = TLC555ID: LinCMOS Timer; Manufacturer: TEXAS INSTRUMENTS; PressFit: No; Bonding: No; Part Number: TLC555ID; Component Kind: Standard; Component Type: Standard; Device: TLC555ID; PackageDescription: SOIC 8, Pitch 1.27mm, Body 4x5mm, IPC Medium Density; Part Description: LinCMOS Timer; Manufacturer Part Number: TLC555ID; Pin Count: 8; Case: SOIC8; Mounted: Yes; Socket: No; SMD: Yes; Sense: No; ComponentHeight: 1.75mm; Author: CERN DEM JMW; HelpURL: \\cern.ch\dfs\Applications\Altium\Datasheets\TLC555ID.pdf; CreateDate: 23.08.2016; LatestRevisionDate: 23.08.2016
J6 = AMPHENOL_10052825-101LF: 72 Contacts Header, 6 Columns, 4 Pairs per Column; Part Description: 72 Contacts, 2mm Pitch, 6 Columns, 4 Pairs per Column, 4 Walls, Right Angle Header; Part Number: AMPHENOL_10052825-101LF; Component Kind: Standard; Component Type: Standard; Pin Count: 72; Family: AirMax VS; Mounted: Yes; Socket: No; SMD: No; PressFit: Yes; Sense: No; Status: None; Manufacturer: AMPHENOL; Manufacturer Part Number: 10052825-101LF; ComponentHeight: 15.35mm; HelpURL: \\cern.ch\dfs\Applications\Altium\Datasheets\AMPHENOL_10052825-101LF.pdf; ComponentLink1URL: \\cern.ch\dfs\Applications\Altium\Datasheets\AMPHENOL_10052825-101LF_Application.pdf; ComponentLink1Description: Application; Author: CERN DEM MR; CreateDate: 19/02/2018; LatestRevisionDate: 19/02/2018; Classname: Overlapping
J7 = AMPHENOL_10052838-101LF: 96 Contacts Header, 8 Columns, 4 Pairs per Column; Part Description: 96 Contacts, 2mm Pitch, 8 Columns, 4 Pairs per Column, 4 Walls, Right Angle Header; Part Number: AMPHENOL_10052838-101LF; Component Kind: Standard; Component Type: Standard; Pin Count: 96; Family: AirMax VS; Mounted: Yes; Socket: No; SMD: No; PressFit: Yes; Sense: No; Status: None; Manufacturer: AMPHENOL; Manufacturer Part Number: 10052838-101LF; ComponentHeight: 15.35mm; HelpURL: \\cern.ch\dfs\Applications\Altium\Datasheets\AMPHENOL_10052838-101LF.pdf; ComponentLink1URL: \\cern.ch\dfs\Applications\Altium\Datasheets\AMPHENOL_10052838-101LF_Application.pdf; ComponentLink1Description: Application; Author: CERN DEM MR; CreateDate: 19.02.2018; LatestRevisionDate: 19.02.2018
R37 R155 R160 R165 R166 R178 R180 R184 R185 = R0603_10K_1%_0.1W_100PPM: Resistor - 1%; Part Description: General Purpose Thick Film Chip Resistor; Manufacturer: GENERIC; Manufacturer1 Part Number: NRC06F1002TRF; Power: 0.1W; TC: ±100ppm/°C; PressFit: No; Part Number: R0603_10K_1%_0.1W_100PPM; Component Kind: Standard; Component Type: Standard; Pin Count: 2; Value: 10k; Status: Preferred; Manufacturer Part Number: R0603_10K_1%_0.1W_100PPM; Case: 0603; Mounted: Yes; Sense: No; Socket: No; SMD: Yes; Manufacturer1 Example: NIC COMPONENT; Manufacturer1 ComponentHeight: 0.55mm; HelpURL: \\cern.ch\dfs\Applications\Altium\Datasheets\R0603_NIC_NRC.pdf; Author: CERN DEM JLC; CreateDate: 03.12.2007; LatestRevisionDate: 13.03.2008
R130 R131 R132#1 R133 R134#1 R135#1 R136 R137#1 R138 R139#1 R140#1 = R0402_22R_1%_0.0625W_100PPM: Resistor - 1%; Part Description: General Purpose Thick Film Chip Resistor; Manufacturer: GENERIC; Manufacturer1 Part Number: 232270672209L; PressFit: No; Part Number: R0402_22R_1%_0.0625W_100PPM; Component Kind: Standard; Component Type: Standard; Pin Count: 2; Value: 22; Status: Not Recommended; Power: 0.0625W; Tolerance: ±1%; Manufacturer Part Number: R0402_22R_1%_0.0625W_100PPM; Case: 0402; Mounted: Yes; Socket: No; SMD: Yes; Manufacturer1 Example: YAGEO PHYCOMP; Manufacturer1 ComponentHeight: 0.4mm; HelpURL: \\cern.ch\dfs\Applications\Altium\Datasheets\R0402_Phycomp_RC0402.pdf; Author: CERN DEM JLC; CreateDate: 03.12.2007; LatestRevisionDate: 17.10.2012; Sense: No
R153 = R0402_22R_1%_0.0625W_100PPM: Resistor - 1%; Part Description: General Purpose Thick Film Chip Resistor; Manufacturer: GENERIC; Manufacturer1 Part Number: 232270672209L; TC: ±100ppm/°C; PressFit: No; Part Number: R0402_22R_1%_0.0625W_100PPM; Component Kind: Standard; Component Type: Standard; Pin Count: 2; Value: 22; Status: Not Recommended; Power: 0.0625W; Manufacturer Part Number: R0402_22R_1%_0.0625W_100PPM; Case: 0402; Mounted: Yes; Sense: No; Socket: No; SMD: Yes; Manufacturer1 Example: YAGEO PHYCOMP; Manufacturer1 ComponentHeight: 0.4mm; HelpURL: \\cern.ch\dfs\Applications\Altium\Datasheets\R0402_Phycomp_RC0402.pdf; Author: CERN DEM JLC; CreateDate: 03.12.2007; LatestRevisionDate: 17.10.2012
R154 = R0402_200R_1%_0.0625W_100PPM: Resistor - 1%; Part Description: General Purpose Thick Film Chip Resistor; Manufacturer: GENERIC; Manufacturer1 Part Number: 232270672001L; TC: ±100ppm/°C; PressFit: No; Part Number: R0402_200R_1%_0.0625W_100PPM; Component Kind: Standard; Component Type: Standard; Pin Count: 2; Value: 200; Status: Not Recommended; Power: 0.0625W; Manufacturer Part Number: R0402_200R_1%_0.0625W_100PPM; Case: 0402; Mounted: Yes; Sense: No; Socket: No; SMD: Yes; Manufacturer1 Example: YAGEO PHYCOMP; Manufacturer1 ComponentHeight: 0.4mm; HelpURL: \\cern.ch\dfs\Applications\Altium\Datasheets\R0402_Phycomp_RC0402.pdf; Author: CERN DEM JLC; CreateDate: 03.12.2007; LatestRevisionDate: 17.10.2012
R179 R183 = R0603_2K7_1%_0.1W_100PPM: Resistor - 1%; Part Description: General Purpose Thick Film Chip Resistor; Manufacturer: GENERIC; Manufacturer1 Part Number: RC0603FR-072K7L; Power: 0.1W; TC: ±100ppm/°C; PressFit: No; Part Number: R0603_2K7_1%_0.1W_100PPM; Component Kind: Standard; Component Type: Standard; Pin Count: 2; Value: 2k7; Status: Preferred; Manufacturer Part Number: R0603_2K7_1%_0.1W_100PPM; Case: 0603; Mounted: Yes; Sense: No; Socket: No; SMD: Yes; Manufacturer1 Example: YAGEO PHYCOMP; Manufacturer1 ComponentHeight: 0.55mm; HelpURL: \\cern.ch\dfs\Applications\Altium\Datasheets\R0603_PHYCOMP_RC0603.pdf; Author: CERN DEM JLC; CreateDate: 02.05.2011; LatestRevisionDate: 02.05.2011
R181 R182 = R0402_0R_JUMPER: Resistor; Part Description: 1A (0.05R Max DC Resistance) Zero Ohm Jumper; Manufacturer: GENERIC; Manufacturer1 Part Number: 232270591001L; PressFit: No; Part Number: R0402_0R_JUMPER; Component Kind: Standard; Component Type: Standard; Pin Count: 2; Value: 0; Status: Not Recommended; Manufacturer Part Number: R0402_0R_JUMPER; Case: 0402; Mounted: Yes; Sense: No; Socket: No; SMD: Yes; Manufacturer1 Example: YAGEO PHYCOMP; Manufacturer1 ComponentHeight: 0.4mm; HelpURL: \\cern.ch\dfs\Applications\Altium\Datasheets\R0402_Phycomp_RC0402.pdf; Author: CERN DEM JLC; CreateDate: 03.12.2007; LatestRevisionDate: 17.10.2012
T1 T2 T19 T20 = BSS138LT1G: N-CHANNEL MOSFET WITH DIODE; Part Description: 50V, 200mA N-Channel Enhancement Mode Field-Effect Transistor; Manufacturer: ON SEMICONDUCTOR; PressFit: No; Bonding: No; Part Number: BSS138LT1G; Component Kind: Standard; Component Type: Standard; Device: BSS138LT1G; PackageDescription: SOT23, 0.95mm Pitch; 3 Pin, 1.40mm W X 3.00mm L X 1.10mm H body, IPC Medium Density; Manufacturer Part Number: BSS138L; Pin Count: 3; Case: SOT23-3; Mounted: Yes; Socket: No; SMD: Yes; Sense: No; ComponentHeight: 1.11mm; HelpURL: \\cern.ch\dfs\Applications\Altium\Datasheets\BSS138LT1G.pdf; Author: CERN DEM JLC; CreateDate: 23.03.2009; LatestRevisionDate: 25.05.2022

## Sheet AFE.SchDoc: Analog Front-End
size A3; Author: M.Beldyga; CompanyName: WUT ISE; DrawnBy: M.Beldyga; Organization: WUT ISE; Address1: PW ISE; Address2: Nowowiejska 15/19 00-665 Warsaw; Address3: micbeldyga@gmail.com; SheetNumber: 3; SheetTotal: 10; ModifiedBy: -; CheckedDate: -; DivGrp: WUT ISE; Designer: M.Beldyga; ModifiedDate: -; ProjectName: Sensor Box
Used 2 times, as channels U_AFE, U_AFE. Parts and nets are listed once, with the designators drawn on the sheet.
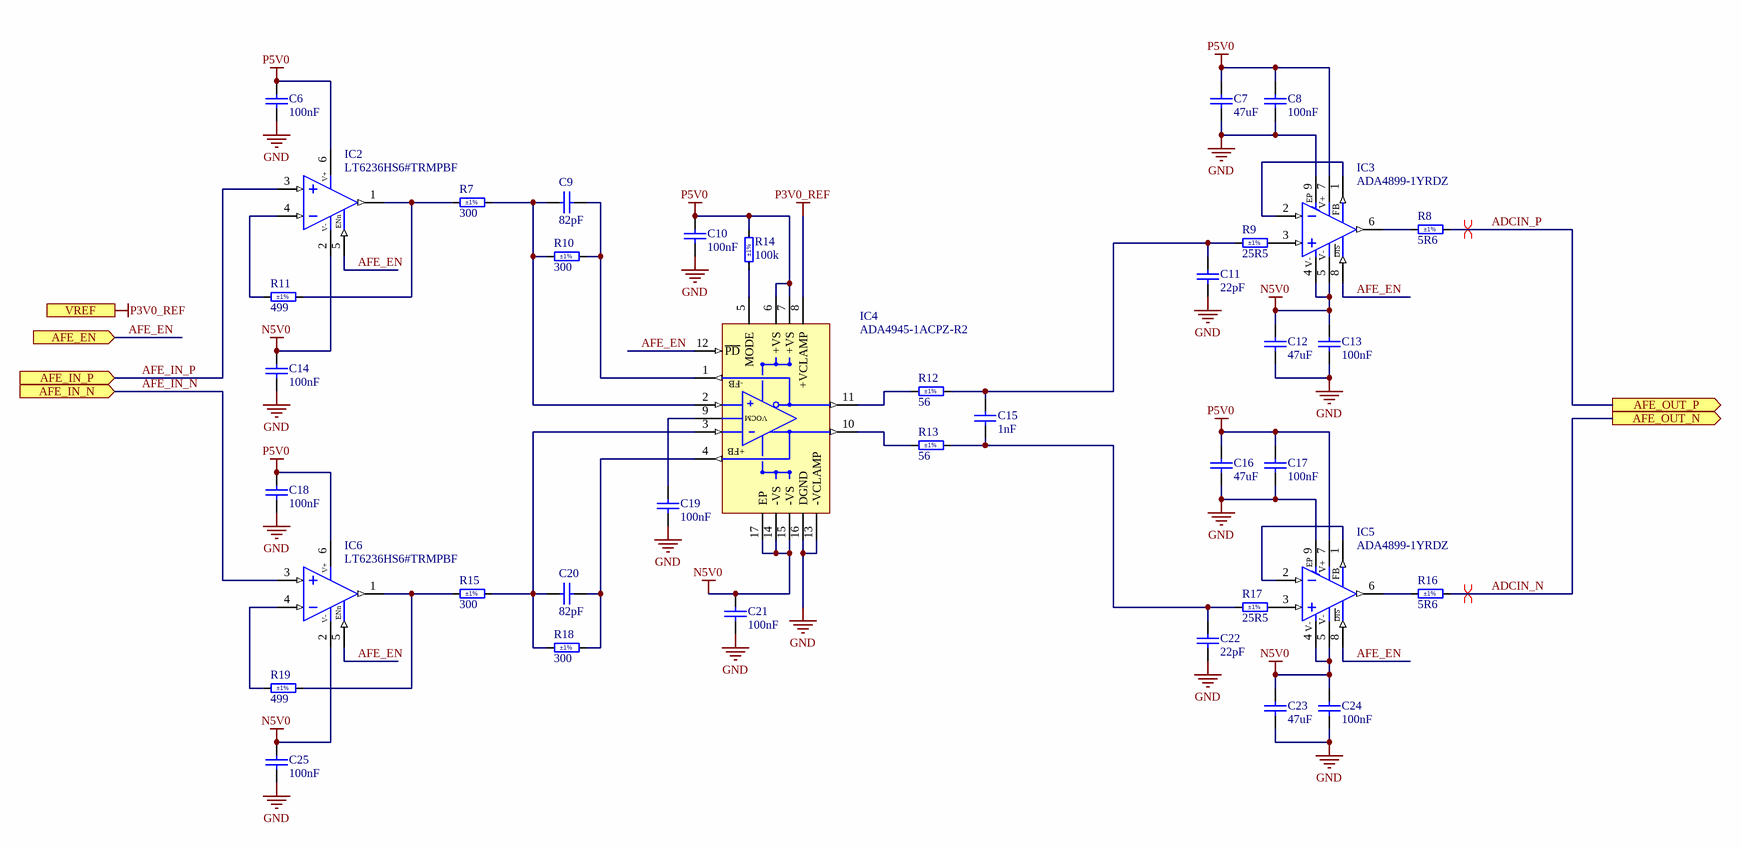
[diagram p2: AFE.SchDoc]

### Parts
C6  100nF  [CAPC1005X55N]
C7  47uF  [CAPC3216X180N]
C8  100nF  [CAPC1005X55N]
C9  82pF  [CAPC1005X55N]
C10  100nF  [CAPC1005X55N]
C11  22pF  [CAPC1005X55N]
C12  47uF  [CAPC3216X180N]
C13  100nF  [CAPC1005X55N]
C14  100nF  [CAPC1005X55N]
C15  1nF  [CAPC1005X55N]
C16  47uF  [CAPC3216X180N]
C17  100nF  [CAPC1005X55N]
C18  100nF  [CAPC1005X55N]
C19  100nF  [CAPC1005X55N]
C20  82pF  [CAPC1005X55N]
C21  100nF  [CAPC1005X55N]
C22  22pF  [CAPC1005X55N]
C23  47uF  [CAPC3216X180N]
C24  100nF  [CAPC1005X55N]
C25  100nF  [CAPC1005X55N]
IC2  LT6236HS6#TRMPBF  [SOT95P280X100-6N]
IC3  ADA4899-1YRDZ  [SOIC127P600X175-9N-S229]
IC4  ADA4945-1ACPZ-R2  [QFN50P300X300X80_HS-17N]
IC5  ADA4899-1YRDZ  [SOIC127P600X175-9N-S229]
IC6  LT6236HS6#TRMPBF  [SOT95P280X100-6N]
R7  300  Tolerance: ±1%  [RESC1005X40N]
R8  5R6  Tolerance: ±1%  [RESC1608X55N]
R9  25R5  Tolerance: ±1%  [RESC1005X40N]
R10  300  Tolerance: ±1%  [RESC1005X40N]
R11  499  Tolerance: ±1%  [RESC1005X40N]
R12  56  Tolerance: ±1%  [RESC1005X40N]
R13  56  Tolerance: ±1%  [RESC1005X40N]
R14  100k  Tolerance: ±1%  [RESC1005X40N]
R15  300  Tolerance: ±1%  [RESC1005X40N]
R16  5R6  Tolerance: ±1%  [RESC1608X55N]
R17  25R5  Tolerance: ±1%  [RESC1005X40N]
R18  300  Tolerance: ±1%  [RESC1005X40N]
R19  499  Tolerance: ±1%  [RESC1005X40N]

### Ports
AFE_EN (in), AFE_IN_N (in), AFE_IN_P (in), AFE_OUT_N (out), AFE_OUT_P (out), VREF

### Nets
GND: C6.1 C7.1 C8.1 C10.1 C11.1 C12.1 C13.1 C14.1 C16.1 C17.1 C18.1 C19.1 C21.1 C22.1 C23.1 C24.1 C25.1 IC3.9(EP) IC4.13(-VCLAMP) IC4.16(DGND) IC5.9(EP)
N5V0: C12.2 C13.2 C14.2 C21.2 C23.2 C24.2 C25.2 IC2.2(GND) IC3.4(V-) IC3.5(V-) IC4.14(-VS) IC4.15(-VS) IC4.17(EP) IC5.4(V-) IC5.5(V-) IC6.2(GND)
P3V0_REF: IC4.8(+VCLAMP) ; port VREF
P5V0: C6.2 C7.2 C8.2 C10.2 C16.2 C17.2 C18.2 IC2.6(VCC) IC3.7(V+) IC4.6(+VS) IC4.7(+VS) IC5.7(V+) IC6.6(VCC) R14.2
ADCIN_N: R16.2 ; port AFE_OUT_N
ADCIN_P: R8.2 ; port AFE_OUT_P
AFE_EN: IC2.5(~{DIS}) IC3.8(~{DIS}) IC4.12(~{PD}) IC5.8(~{DIS}) IC6.5(~{DIS}) ; port AFE_EN
AFE_IN_N: IC6.3(VP) ; port AFE_IN_N
AFE_IN_P: IC2.3(VP) ; port AFE_IN_P
NetC9_1: C9.1 IC4.2(+IN) R7.2 R10.1
NetC9_2: C9.2 IC4.1(-FB) R10.2
NetC11_2: C11.2 C15.2 R9.1 R12.2
NetC15_1: C15.1 C22.2 R13.2 R17.1
NetC19_2: C19.2 IC4.9(VOCM)
NetC20_1: C20.1 IC4.3(-IN) R15.2 R18.1
NetC20_2: C20.2 IC4.4(+FB) R18.2
NetIC2_1: IC2.1(q) R7.1 R11.2
NetIC2_4: IC2.4(VN) R11.1
NetIC3_1: IC3.1(FB) IC3.2(IN-)
NetIC3_3: IC3.3(IN+) R9.2
NetIC3_6: IC3.6(OUT) R8.1
NetIC4_5: IC4.5(MODE) R14.1
NetIC4_10: IC4.10(+OUT) R13.1
NetIC4_11: IC4.11(-OUT) R12.1
NetIC5_1: IC5.1(FB) IC5.2(IN-)
NetIC5_3: IC5.3(IN+) R17.2
NetIC5_6: IC5.6(OUT) R16.1
NetIC6_1: IC6.1(q) R15.1 R19.2
NetIC6_4: IC6.4(VN) R19.1

### Channels
U_AFE: designators end in B; ports AFE_EN=AFE_EN AFE_IN_N=AFE_IN_N AFE_IN_P=AFE_IN_P AFE_OUT_N=ADCIN_N AFE_OUT_P=ADCIN_P VREF=P3V0_REF
U_AFE: designators end in A; ports AFE_EN=AFE_EN AFE_IN_N=AFE_IN_N AFE_IN_P=AFE_IN_P AFE_OUT_N=ADCIN_N AFE_OUT_P=ADCIN_P VREF=P3V0_REF

### Layout directives
differential pair; net class ADC_IN: ADCIN_N, ADCIN_P

### Notes on the sheet
- Project/Equipment
- Document
- Designer
- Drawn by
- Check.by
- Contact
- File
- Last Mod.
- Print Date
- Sheet
- Size
- A3
- of
- Rev
- (in symbol ADA4899-1YRDZ) DIS
- (in symbol LT6236HS6#TRMPBF) V+; ENn; V-

### Library data of the parts
C6 C8 C10 C13 C14 C17-C19 C21 C24 C25 = CC0402_100NF_50V_10%_X7R: as C1 on sheet CPCIS_Connectors_P1_P6; Part Number: CC0402_100NF_50V_10%_X7R; Component Kind: Standard; Component Type: Standard; Pin Count: 2; Value: 100nF; Status: None; Manufacturer Part Number: CC0402_100NF_50V_10%_X7R; Case: 0402; Mounted: Yes; Socket: No; SMD: Yes; Sense: No; Manufacturer1 Example: MURATA; Manufacturer1 ComponentHeight: 0.55mm; HelpURL: \\cern.ch\dfs\Applications\Altium\Datasheets\CC0402_MURATA_GRM155R71H104KE14D.pdf; Author: CERN DEM MR; CreateDate: 6/30/2017; LatestRevisionDate: 6/30/2017
C7 C12 C16 C23 = CC1206_47UF_25V_20%_X5R: Non-polarised capacitor; Part Description: SMD Multilayer Chip Ceramic Capacitor; Manufacturer: GENERIC; Manufacturer1 Part Number: C3216X5R1E476M160; Voltage: 25V; TC: X5R; Tolerance: ±20%; Part Number: CC1206_47UF_25V_20%_X5R; Component Kind: Standard; Component Type: Standard; Pin Count: 2; Value: 47uF; Status: None; Manufacturer Part Number: CC1206_47UF_25V_20%_X5R; Case: 1206; Mounted: Yes; Socket: No; SMD: Yes; Sense: No; Manufacturer1 Example: TDK; Manufacturer1 ComponentHeight: 1.8mm; HelpURL: \\cern.ch\dfs\Applications\Altium\Datasheets\CC1206_X5R_TDK_C.pdf; Author: CERN DEM JLC; CreateDate: 11/20/2013; LatestRevisionDate: 3/14/2017
C9 C20 = CC0402_82PF_25V_1%_C0G_KEMET_HiQ-CBR: Non-polarised capacitor; Part Description: High Q and low ESR, SMD Multilayer Chip Ceramic Capacitor, HiQ-CBR Series; Manufacturer: KEMET; Manufacturer Part Number: CBR04C820F3GAC; Voltage: 25V; TC: C0G/NP0; Tolerance: ±1%; Part Number: CC0402_82PF_25V_1%_C0G_KEMET_HiQ-CBR; Component Kind: Standard; Component Type: Standard; Pin Count: 2; Value: 82pF; Status: Not Recommended; Case: 0402; Mounted: Yes; Socket: No; SMD: Yes; Sense: No; ComponentHeight: 0.55mm; HelpURL: \\cern.ch\dfs\Applications\Altium\Datasheets\CC0402_C0G_KEMET_HiQ-CBR.pdf; Author: CERN DEM MR; CreateDate: 11/17/2017; LatestRevisionDate: 11/21/2017
C11 C22 = CC0402_22PF_50V_5%_C0G: as C2 on sheet ADC_40M20b; Part Number: CC0402_22PF_50V_5%_C0G; Component Kind: Standard; Component Type: Standard; Pin Count: 2; Value: 22pF; Status: Preferred; Manufacturer Part Number: CC0402_22PF_50V_5%_C0G; Case: 0402; Mounted: Yes; Socket: No; SMD: Yes; Sense: No; Manufacturer1 Example: KEMET; Manufacturer1 ComponentHeight: 0.55mm; HelpURL: \\cern.ch\dfs\Applications\Altium\Datasheets\CC0402_C0G_KEMET_(Commercial Grade).pdf; Author: CERN DEM JLC; CreateDate: 12/3/2007; LatestRevisionDate: 12/3/2007
C15 = CC0402_1NF_50V_10%_X7R: Non-polarised capacitor; Part Description: SMD Multilayer Chip Ceramic Capacitor; Manufacturer: GENERIC; Manufacturer1 Part Number: 223858715623; Voltage: 50V; TC: X7R; Tolerance: ±10%; Part Number: CC0402_1NF_50V_10%_X7R; Component Kind: Standard; Component Type: Standard; Pin Count: 2; Value: 1nF; Status: Not Recommended; Manufacturer Part Number: CC0402_1NF_50V_10%_X7R; Case: 0402; Mounted: Yes; Socket: No; SMD: Yes; Sense: No; Manufacturer1 Example: PHYCOMP; Manufacturer1 ComponentHeight: 0.55mm; HelpURL: \\cern.ch\dfs\Applications\Altium\Datasheets\CC0402_X7R_PHYCOMP.pdf; Author: CERN DEM JLC; CreateDate: 12/3/2007; LatestRevisionDate: 12/3/2007
IC2 IC6 = LT6236HS6#TRMPBF: Rail-to-Rail Output 215MHz, 1.1nV/√Hz Op Amp/SAR ADC Driver; Manufacturer: Linear Technology; Part Number: LT6236HS6#TRMPBF; Component Kind: Standard; Component Type: Standard; Device: LT6236HS6#TRMPBF; PackageDescription: SOT23, 0.95mm pitch; 6 pin, 1.625mm W X 2.90mm L X 1.00mm H body, IPC Medium Density; Part Description: Rail-to-Rail Output 215MHz, 1.1nV/√Hz Op Amp/SAR ADC Driver; Manufacturer Part Number: LT6236HS6#TRMPBF; Pin Count: 6; Case: SOT23-6; Status: Active; Author: Michal Beldyga; CreateDate: 1/31/2025; LastRevision: 1/31/2025
IC3 IC5 = ADA4899-1YRDZ: Unity-Gain Stable, Ultralow Distortion, 1 nV/sqrt Hz Voltage Noise, High Speed Operational Amplifier; Manufacturer: ANALOG DEVICES; PressFit: No; Bonding: No; Part Number: ADA4899-1YRDZ; Component Kind: Standard; Component Type: Standard; Device: ADA4899-1YRDZ; PackageDescription: SOIC, 1.27mm Pitch; 8 Pin, 3.90mm W X 4.90mm L X 1.75mm H body (w/Thermal Tab 2.29 X 2.29mm), IPC Medium Density; Part Description: Unity-Gain Stable, Ultralow Distortion, 1nV/sqrt Hz Voltage Noise, High Speed Operational Amplifier; Manufacturer Part Number: ADA4899-1YRD; Pin Count: 9; Case: SOIC8; Mounted: Yes; Socket: No; SMD: Yes; Sense: No; ComponentHeight: 1.75mm; Author: CERN DEM JLC; HelpURL: \\cern.ch\dfs\Applications\Altium\Datasheets\ADA4899-1YRDZ.pdf; CreateDate: 1/13/2010; LatestRevisionDate: 3/31/2022
IC4 = ADA4945-1ACPZ-R2: High Speed, ±0.1 µV/˚C Offset Drift, Fully Differential ADC Driver; Manufacturer: Analog Devices; Part Number: ADA4945-1ACPZ-R2; Component Kind: Standard; Component Type: Standard; Device: ADA4945-1ACPZ-R2; PackageDescription: QFN, 16-Leads, Body 3.00x3.00mm, Pitch 0.50mm, Thermal Pad 1.60x1.60mm, IPC Medium Density; Part Description: High Speed, ±0.1 µV/˚C Offset Drift, Fully Differential ADC Driver; Manufacturer Part Number: ADA4945-1ACPZ-R2; Pin Count: 17; Case: QFN; Status: Active; Author: Michal Beldyga; CreateDate: 1/31/2025; LastRevision: 1/31/2025
R7 R10 R15 R18 = R0402_300R_1%_0.0625W_100PPM: Resistor - 1%; Part Description: General Purpose Thick Film Chip Resistor; Manufacturer: GENERIC; Manufacturer1 Part Number: 232270673001L; TC: ±100ppm/°C; PressFit: No; Part Number: R0402_300R_1%_0.0625W_100PPM; Component Kind: Standard; Component Type: Standard; Pin Count: 2; Value: 300; Status: Not Recommended; Power: 0.0625W; Manufacturer Part Number: R0402_300R_1%_0.0625W_100PPM; Case: 0402; Mounted: Yes; Sense: No; Socket: No; SMD: Yes; Manufacturer1 Example: YAGEO PHYCOMP; Manufacturer1 ComponentHeight: 0.4mm; HelpURL: \\cern.ch\dfs\Applications\Altium\Datasheets\R0402_Phycomp_RC0402.pdf; Author: CERN DEM JLC; CreateDate: 12/3/2007; LatestRevisionDate: 10/17/2012
R8 R16 = R0603_5R6_1%_0.1W_200PPM: Resistor - 1%; Part Description: General Purpose Thick Film Chip Resistor; Manufacturer: GENERIC; Manufacturer1 Part Number: 232270465608L or RC0603FR-075R6L; Power: 0.1W; TC: ±200ppm/°C; PressFit: No; Part Number: R0603_5R6_1%_0.1W_200PPM; Component Kind: Standard; Component Type: Standard; Pin Count: 2; Value: 5R6; Status: Preferred; Manufacturer Part Number: R0603_5R6_1%_0.1W_200PPM; Case: 0603; Mounted: Yes; Sense: No; Socket: No; SMD: Yes; Manufacturer1 Example: YAGEO PHYCOMP; Manufacturer1 ComponentHeight: 0.65mm; HelpURL: \\cern.ch\dfs\Applications\Altium\Datasheets\R0603_Phycomp_RC0603.pdf; Author: CERN DEM JLC; CreateDate: 6/24/2009; LatestRevisionDate: 10/17/2012
R9 R17 = R0402_25R5_1%_0.0625W_100PPM: Resistor - 1%; Part Description: General Purpose Thick Film Chip Resistor; Manufacturer: GENERIC; Manufacturer1 Part Number: CRCW040225R5FK; TC: ±100ppm/°C; PressFit: No; Part Number: R0402_25R5_1%_0.0625W_100PPM; Component Kind: Standard; Component Type: Standard; Pin Count: 2; Value: 25R5; Status: None; Power: 0.0625W; Manufacturer Part Number: R0402_25R5_1%_0.0625W_100PPM; Case: 0402; Mounted: Yes; Sense: No; Socket: No; SMD: Yes; Manufacturer1 Example: VISHAY; Manufacturer1 ComponentHeight: 0.4mm; HelpURL: \\cern.ch\dfs\Applications\Altium\Datasheets\R0402_VISHAY_CRCW e3.pdf; Author: CERN DEM JLC; CreateDate: 10/4/2016; LatestRevisionDate: 10/4/2016
R11 R19 = R0402_499R_1%_0.1W_100PPM: Resistor - 1%; Part Description: General Purpose Thick Film Chip Resistor; Manufacturer: GENERIC; Manufacturer1 Part Number: ERJ2RKF4990X; Power: 0.1W; TC: ±100ppm/°C; Voltage: 50V; PressFit: No; Part Number: R0402_499R_1%_0.1W_100PPM; Component Kind: Standard; Component Type: Standard; Pin Count: 2; Value: 499; Status: Not Recommended; Manufacturer Part Number: R0402_499R_1%_0.1W_100PPM; Case: 0402; Mounted: Yes; Sense: No; Socket: No; SMD: Yes; Manufacturer1 Example: PANASONIC; Manufacturer1 ComponentHeight: 0.4mm; HelpURL: \\cern.ch\dfs\Applications\Altium\Datasheets\R0402_PANASONIC_ERJ2RK.pdf; Author: CERN DEM MR; CreateDate: 11/22/2016; LatestRevisionDate: 11/22/2016
R12 R13 = R0402_56R_1%_0.0625W_100PPM: Resistor - 1%; Part Description: General Purpose Thick Film Chip Resistor; Manufacturer: GENERIC; Manufacturer1 Part Number: 232270675609L; TC: ±100ppm/°C; PressFit: No; Part Number: R0402_56R_1%_0.0625W_100PPM; Component Kind: Standard; Component Type: Standard; Pin Count: 2; Value: 56; Status: Not Recommended; Power: 0.0625W; Manufacturer Part Number: R0402_56R_1%_0.0625W_100PPM; Case: 0402; Mounted: Yes; Sense: No; Socket: No; SMD: Yes; Manufacturer1 Example: YAGEO PHYCOMP; Manufacturer1 ComponentHeight: 0.4mm; HelpURL: \\cern.ch\dfs\Applications\Altium\Datasheets\R0402_Phycomp_RC0402.pdf; Author: CERN DEM JLC; CreateDate: 12/3/2007; LatestRevisionDate: 10/17/2012
R14 = R0402_100K_1%_0.0625W_100PPM: Resistor - 1%; Part Description: General Purpose Thick Film Chip Resistor; Manufacturer: GENERIC; Manufacturer1 Part Number: 232270671004L; TC: ±100ppm/°C; PressFit: No; Part Number: R0402_100K_1%_0.0625W_100PPM; Component Kind: Standard; Component Type: Standard; Pin Count: 2; Value: 100k; Status: Not Recommended; Power: 0.0625W; Manufacturer Part Number: R0402_100K_1%_0.0625W_100PPM; Case: 0402; Mounted: Yes; Sense: No; Socket: No; SMD: Yes; Manufacturer1 Example: YAGEO PHYCOMP; Manufacturer1 ComponentHeight: 0.4mm; HelpURL: \\cern.ch\dfs\Applications\Altium\Datasheets\R0402_Phycomp_RC0402.pdf; Author: CERN DEM JLC; CreateDate: 12/3/2007; LatestRevisionDate: 10/17/2012

## Sheet LNA.SchDoc: Low Noise Amplifier
size A3; Author: M.Beldyga; CompanyName: WUT ISE; DrawnBy: M.Beldyga; Organization: WUT ISE; Address1: PW ISE; Address2: Nowowiejska 15/19 00-665 Warsaw; Address3: micbeldyga@gmail.com; SheetNumber: 4; SheetTotal: 10; ModifiedBy: -; CheckedDate: -; DivGrp: WUT ISE; Designer: M.Beldyga; ModifiedDate: -; ProjectName: Sensor Box
Used 2 times, as channels U_LNA, U_LNA. Parts and nets are listed once, with the designators drawn on the sheet.
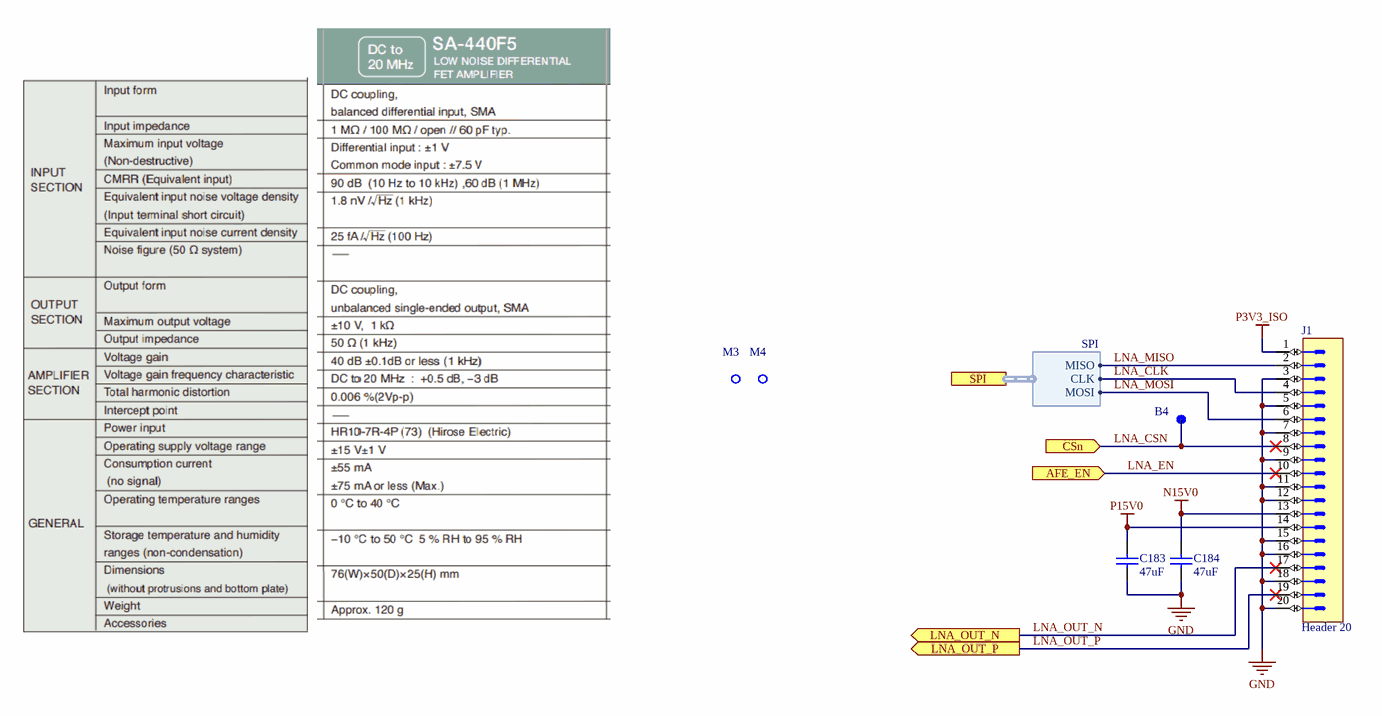
[diagram p3: LNA.SchDoc]

### Parts
B4  SMD Pad  [C100]  (value not drawn)  (no BOM)
C183  47uF  [CAPC3216X180N]
C184  47uF  [CAPC3216X180N]
J1  Header 20  [SAMTEC_HTSW-110-23-L-D]
M3  Plated Hole  [MTG300_600]  (value not drawn)  (no BOM)
M4  Plated Hole  [MTG300_600]  (value not drawn)  (no BOM)

### Ports
AFE_EN (in), CSn (in), LNA_OUT_N (out), LNA_OUT_P (out), SPI (harness SPI)

### Harnesses
SPI: CLK, MOSI, MISO

### Nets
GND: C183.2 C184.2 J1.3 J1.5 J1.7 J1.9 J1.11 J1.12 J1.15 J1.16 J1.18 J1.20
N15V0: C184.1 J1.13
P3V3_ISO: J1.1
P15V0: C183.1 J1.14
LNA_CLK: J1.4 ; port SPI.CLK
LNA_CSN: B4.1 J1.8 ; port CSn
LNA_EN: J1.10 ; port AFE_EN
LNA_MISO: J1.2 ; port SPI.MISO
LNA_MOSI: J1.6 ; port SPI.MOSI
LNA_OUT_N: J1.17 ; port LNA_OUT_N
LNA_OUT_P: J1.19 ; port LNA_OUT_P

Not connected (* = marked no-connect by the designer): M3 1; M4 1

### Channels
U_LNA: designators end in B; ports AFE_EN=AFE_EN CSn=CSn_LNA_CH_A LNA_OUT_N=AFE_IN_N LNA_OUT_P=AFE_IN_P
U_LNA: designators end in A; ports AFE_EN=AFE_EN CSn=CSn_LNA_CH_B LNA_OUT_N=AFE_IN_N LNA_OUT_P=AFE_IN_P

### Notes on the sheet
- Project/Equipment
- Document
- Designer
- Drawn by
- Check.by
- Contact
- File
- Last Mod.
- Print Date
- Sheet
- Size
- A3
- of
- Rev

### Library data of the parts
B4 = SMD_PAD_D1MM: Pad; Part Description: 1mm Diameter SMD Pad; Mounted: No; Part Number: SMD_PAD_D1MM; Component Type: Standard (No BOM); Pin Count: 1; Family: SMD Pad; Socket: No; SMD: Yes; Sense: No; Status: None; ComponentHeight: 0mm; HelpURL: Undefined; Author: CERN DEM JLC; CreateDate: 10/10/2017; LatestRevisionDate: 10/10/2017; PackageDescription: 1mm Diameter SMD Pad
C183 C184 = CC1206_47UF_25V_20%_X5R: Non-polarised capacitor; Part Description: SMD Multilayer Chip Ceramic Capacitor; Manufacturer: TDK; Manufacturer Part Number: C3216X5R1E476M160AC; Voltage: 25V; TC: X5R; Tolerance: ±20%; Table: Capacitors SMD; Part Number: CC1206_47UF_25V_20%_X5R; Component Kind: Standard; Component Type: Standard; Pin Count: 2; Value: 47uF; Status: None; Case: 1206; Mounted: Yes; Socket: No; SMD: Yes; HelpURL: \\cern.ch\dfs\Applications\Altium\Datasheets\CC1206_X5R_TDK_C.pdf; Author: CERN DEM JLC; CreateDate: 2013-11-20; LatestRevisionDate: 2013-11-20; ComponentHeight: 1.8mm
J1 = SAMTEC_HTSW-110-23-L-D: Connector 20 Male; Part Description: 20 Contacts, Pitch 2.54mm, Dual Row Through Mount Straight Header (Post Lead 5.84mm, Tail Lead 2.92mm, Insulator 2.54mm); Manufacturer: SAMTEC; PressFit: No; Status Comment: High Temperature; Part Number: SAMTEC_HTSW-110-23-L-D; Component Kind: Standard; Component Type: Standard; Pin Count: 20; Family: Header 20; Mounted: Yes; Socket: No; SMD: No; Sense: No; Status: Preferred; Manufacturer Part Number: HTSW-110-23-L-D; ComponentHeight: 8.38mm; HelpURL: \\cern.ch\dfs\Applications\Altium\Datasheets\SAMTEC_HTSW-110-23-L-D.pdf; Author: CERN DEM JLC; CreateDate: 2/22/2018; LatestRevisionDate: 2/22/2018
M3 M4 = PLATED_HOLE3.0_PAD6.0: as M1 on sheet ADC_40M20b; Part Number: PLATED_HOLE3.0_PAD6.0; Component Type: Standard (No BOM); Designator: Single Terminal Socket; Library Reference: Single Terminal Socket; Pin Count: 1; Family: Plated Hole; Socket: No; SMD: No; Status: None; ComponentHeight: 0mm; Author: CERN DEM JLC; CreateDate: 26.05.2008; LatestRevisionDate: 26.05.2008; PackageDescription: Plated Through Hole: Hole Dia.=3.0mm Pad Dia.=6.0mm